# Altium project 4P_JST-PH-3_EXT.PrjPcb
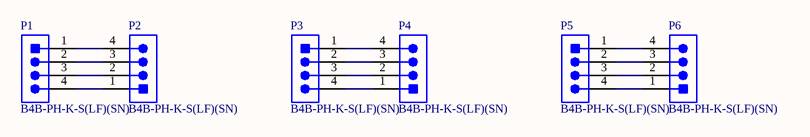
[diagram p0: 4P_JST-PH-3_EXT.SchDoc]
1 sheet, 6 parts. Net scope: global (net labels, ports and power ports of the same name join across sheets).
Board file: 4P_JST-PH-3_EXT.PcbDoc

## Sheet 4P_JST-PH-3_EXT.SchDoc
size A4

### Parts
P1  B4B-PH-K-S(LF)(SN)  [JST-B4B-PH-K-S_V]
P2  B4B-PH-K-S(LF)(SN)  [JST-B4B-PH-K-S_V]
P3  B4B-PH-K-S(LF)(SN)  [JST-B4B-PH-K-S_V]
P4  B4B-PH-K-S(LF)(SN)  [JST-B4B-PH-K-S_V]
P5  B4B-PH-K-S(LF)(SN)  [JST-B4B-PH-K-S_V]
P6  B4B-PH-K-S(LF)(SN)  [JST-B4B-PH-K-S_V]

### Nets
NetP1_1: P1.1 P2.4
NetP1_2: P1.2 P2.3
NetP1_3: P1.3 P2.2
NetP1_4: P1.4 P2.1
NetP3_1: P3.1 P4.4
NetP3_2: P3.2 P4.3
NetP3_3: P3.3 P4.2
NetP3_4: P3.4 P4.1
NetP5_1: P5.1 P6.4
NetP5_2: P5.2 P6.3
NetP5_3: P5.3 P6.2
NetP5_4: P5.4 P6.1

### Library data of the parts
P1-P6 = CMP-2000-05165-1: Male Header, Pitch 2 mm, 1 x 4 Position, Height 6 mm, Tail Length 3.4 mm, -25 to 85 degC, RoHS, Bulk; Manufacturer: JST; No of Positions: 4; Style/Orientation: StraightHeader/Plug; Pitch: 2mm; Datasheet URL: http://datasheet.octopart.com/B4B-PH-K-S%28LF%29%28SN%29-JST-datasheet-10558886.pdf; Type: ShroudedHeader; Manufacturer URL: http://www.jst.com/home2.html; Termination: Crimp; Datasheet Version: Apr-09